# Altium project stm32f103.PrjPcb
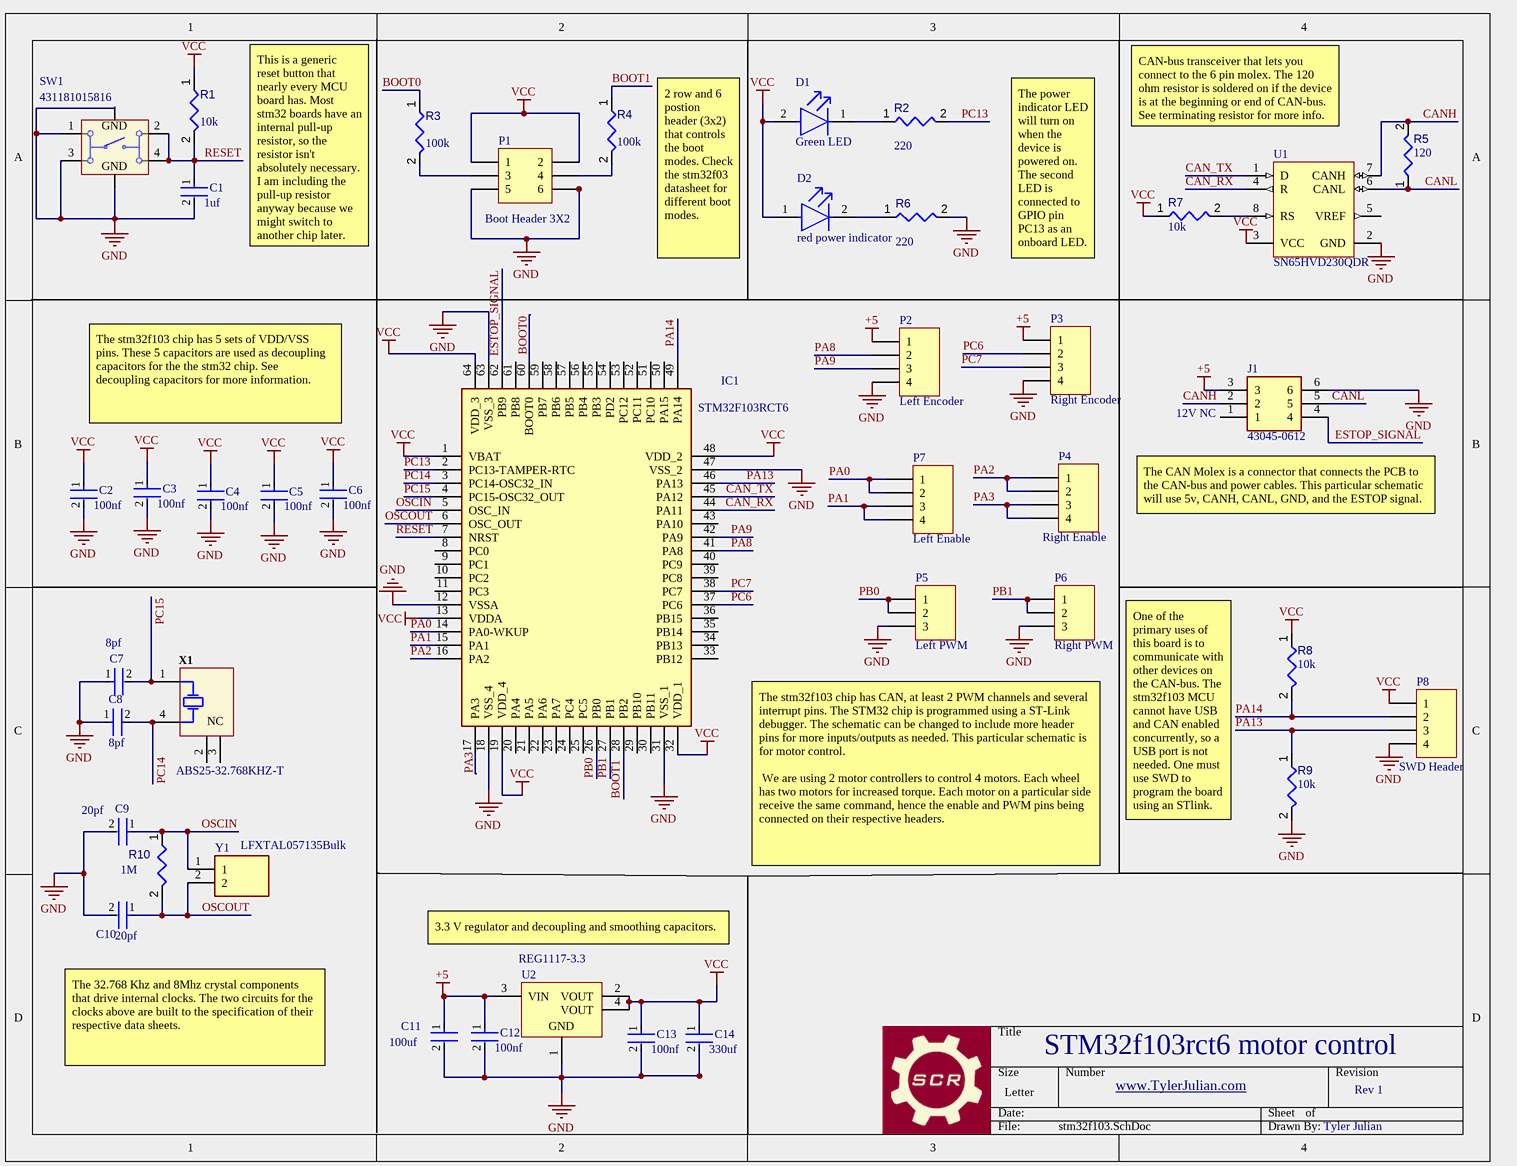
[diagram p0: stm32f103.SchDoc]
DrawnBy: Tyler Julian; Title: Stm32f103 Motor control board.
1 sheet, 41 parts. Net scope: global (net labels, ports and power ports of the same name join across sheets).
Board file: stm32f103.PcbDoc

## Sheet stm32f103.SchDoc: stm32f103 dev board
size Letter; Date: 0; ApprovedBy: 0*; CheckedBy: 0*; Author: 0*; CompanyName: 0; DrawnBy: 0; Engineer: 0*; Organization: 0; Address1: 0; Address2: 0*; Address3: 0*; Address4: 0; DocumentNumber: 0*; SheetNumber: 0; SheetTotal: 0; Parameter 1: 0; Time: 0*; ImagePath: 0*; Application_BuildNumber: 0*

### Parts
C1  1uf  [FP-GCJ21B-0_3-MFG]
C2  100nf  [FP-GCJ21B-0_3-MFG]
C3  100nf  [FP-GCJ21B-0_3-MFG]
C4  100nf  [FP-GCJ21B-0_3-MFG]
C5  100nf  [FP-GCJ21B-0_3-MFG]
C6  100nf  [FP-GCJ21B-0_3-MFG]
C7  8pf  [FP-GCJ21B-0_3-MFG]
C8  8pf  [FP-GCJ21B-0_3-MFG]
C9  20pf  [FP-GCJ21B-0_3-MFG]
C10  20pf  [FP-GCJ21B-0_3-MFG]
C11  100uf  [FP-GCJ21B-0_3-MFG]
C12  100nf  [FP-GCJ21B-0_3-MFG]
C13  100nf  [FP-GCJ21B-0_3-MFG]
C14  330uf  [FP-GCJ21B-0_3-MFG]
D1  Green LED  [FP-LG_R971-MFG]
D2  red power indicator  [FP-LH_R974-MFG]
IC1  STM32F103RCT6  [QFP50P1200X1200X160-64N]
J1  43045-0612  [430450612]
P1  Boot Header 3X2  [HDR2X3]
P2  Left Encoder  [HDR1X4]
P3  Right Encoder  [HDR1X4]
P4  Right Enable  [HDR1X4]
P5  Left PWM  [HDR1X3]
P6  Right PWM  [HDR1X3]
P7  Left Enable  [HDR1X4]
P8  SWD Header  [HDR1X4]
R1  value 10k  [RESC2013X50X35ML15T15]  (hidden comment: Resistor 10k +/-1% 0805 125 mW)
R2  value 220  [RESC2013X50X35ML15T15]  (hidden comment: Resistor 10k +/-1% 0805 125 mW)
R3  value 100k  [RESC2013X50X35ML15T15]  (hidden comment: Resistor 10k +/-1% 0805 125 mW)
R4  value 100k  [RESC2013X50X35ML15T15]  (hidden comment: Resistor 10k +/-1% 0805 125 mW)
R5  value 120  [RESC2013X50X35ML15T15]  (hidden comment: Resistor 10k +/-1% 0805 125 mW)
R6  value 220  [RESC2013X50X35ML15T15]  (hidden comment: Resistor 10k +/-1% 0805 125 mW)
R7  value 10k  [RESC2013X50X35ML15T15]  (hidden comment: Resistor 10k +/-1% 0805 125 mW)
R8  value 10k  [RESC2013X50X35ML15T15]  (hidden comment: Resistor 10k +/-1% 0805 125 mW)
R9  value 10k  [RESC2013X50X35ML15T15]  (hidden comment: Resistor 10k +/-1% 0805 125 mW)
R10  value 1M  [RESC2013X50X35ML15T15]  (hidden comment: Resistor 10k +/-1% 0805 125 mW)
SW1  431181015816  [431181015816]
U1  SN65HVD230QDR  [D0008A_L]
U2  REG1117-3.3  [DCY0004A_M]
X1  ABS25-32.768KHZ-T  [ABRA-ABS25-4_V]
Y1  LFXTAL057135Bulk  [LFXTAL057135Bulk]

### Nets
+5: C11.1 C12.1 J1.3 P2.1 P3.1 U2.3(VIN)
GND: C1.2 C2.2 C3.2 C4.2 C5.2 C6.2 C7.1 C8.1 C9.2 C10.2 C11.2 C12.2 C13.2 C14.2 IC1.12(VSSA) IC1.18(VSS_4) IC1.31(VSS_1) IC1.47(VSS_2) IC1.63(VSS_3) J1.6 P1.5 P1.6 P2.4 P3.4 P5.3 P6.3 P8.4 R6.2 R9.2 SW1.1 SW1.3 SW1.5 SW1.6 U1.2(GND) U2.1(GND)
VCC: C2.1 C3.1 C4.1 C5.1 C6.1 C13.1 C14.1 D1.2(A) D2.1(A) IC1.1(VBAT) IC1.13(VDDA) IC1.19(VDD_4) IC1.32(VDD_1) IC1.48(VDD_2) IC1.64(VDD_3) P1.1 P1.2 P8.1 R1.1 R7.1 R8.1 U1.3(VCC) U2.2(VOUT) U2.4(VOUT)
BOOT0: IC1.60(BOOT0) R3.1
BOOT1: IC1.28(PB2) R4.1
CAN_RX: IC1.44(PA11) U1.4(R)
CAN_TX: IC1.45(PA12) U1.1(D)
CANH: J1.2 R5.2 U1.7(CANH)
CANL: J1.5 R5.1 U1.6(CANL)
ESTOP_SIGNAL: IC1.62(PB9) J1.4
OSCIN: C9.1 IC1.5(OSC_IN) R10.1 Y1.1
OSCOUT: C10.1 IC1.6(OSC_OUT) R10.2 Y1.2
PA0: IC1.14(PA0-WKUP) P7.1 P7.2
PA1: IC1.15(PA1) P7.3 P7.4
PA2: IC1.16(PA2) P4.1 P4.2
PA3: IC1.17(PA3) P4.3 P4.4
PA8: IC1.41(PA8) P2.2
PA9: IC1.42(PA9) P2.3
PA13: IC1.46(PA13) P8.3 R9.1
PA14: IC1.49(PA14) P8.2 R8.2
PB0: IC1.26(PB0) P5.1 P5.2
PB1: IC1.27(PB1) P6.1 P6.2
PC6: IC1.37(PC6) P3.2
PC7: IC1.38(PC7) P3.3
PC13: IC1.2(PC13-TAMPER-RTC) R2.2
PC14: C8.2 IC1.3(PC14-OSC32_IN) X1.4(X2)
PC15: C7.2 IC1.4(PC15-OSC32_OUT) X1.1(X1)
RESET: C1.1 IC1.7(NRST) R1.2 SW1.2 SW1.4
NetD1_1: D1.1(C) R2.1
NetD2_2: D2.2(C) R6.1
NetP1_3: P1.3 R3.2
NetP1_4: P1.4 R4.2
NetR7_2: R7.2 U1.8(RS)

Not connected (* = marked no-connect by the designer): IC1 8(PC0) 9(PC1) 10(PC2) 11(PC3) 20(PA4) 21(PA5) 22(PA6) 23(PA7) 24(PC4) 25(PC5) 29(PB10) 30(PB11) 33(PB12) 34(PB13) 35(PB14) 36(PB15) 39(PC8) 40(PC9) 43(PA10) 50(PA15) 51(PC10) 52(PC11) 53(PC12) 54(PD2) 55(PB3) 56(PB4) 57(PB5) 58(PB6) 59(PB7) 61(PB8); J1 1; U1 5(VREF); X1 2(NC) 3(NC)

### Notes on the sheet
- CAN-bus transceiver that lets you connect to the 6 pin molex. The 120 ohm resistor is soldered on if the device is at the beginning or end of CAN-bus. See terminating resistor for more info.
- This is a generic reset button that nearly every MCU board has. Most stm32 boards have an internal pull-up resistor, so the resistor isn't absolutely necessary. I am including the pull-up resistor anyway because we might switch to another chip later.
- 2 row and 6 postion header (3x2) that controls the boot modes. Check the stm32f03 datasheet for different boot modes.
- The power indicator LED will turn on when the device is powered on. The second LED is connected to GPIO pin PC13 as an onboard LED.
- The stm32f103 chip has 5 sets of VDD/VSS pins. These 5 capacitors are used as decoupling capacitors for the the stm32 chip. See decoupling capacitors for more information.
- (near J1) 12V NC
- (near J1) The CAN Molex is a connector that connects the PCB to the CAN-bus and power cables. This particular schematic will use 5v, CANH, CANL, GND, and the ESTOP signal.
- One of the primary uses of this board is to communicate with other devices on the CAN-bus. The stm32f103 MCU cannot have USB and CAN enabled concurrently, so a USB port is not needed. One must use SWD to program the board using an STlink.
- The stm32f103 chip has CAN, at least 2 PWM channels and several interrupt pins. The STM32 chip is programmed using a ST-Link debugger. The schematic can be changed to include more header pins for more inputs/outputs as needed. This particular schematic is for motor control.
  We are using 2 motor controllers to control 4 motors. Each wheel has two motors for increased torque. Each motor on a particular side receive the same command, hence the enable and PWM pins being connected on their respective headers.
- (near U2) 3.3 V regulator and decoupling and smoothing capacitors.
- The 32.768 Khz and 8Mhz crystal components that drive internal clocks. The two circuits for the clocks above are built to the specification of their respective data sheets.
- STM32f103rct6 motor control
- www.TylerJulian.com <http://www.TylerJulian.com>
- Rev 1
- Tyler Julian
- 10
- 9
- 8
- 7
- 6
- 5
- 4
- 3
- DWG. NO.
- 2
- 1
- REV.
- SHT.
- REVISION
- DESCRIPTION
- DATE
- APPROVED
- H
- THIS DOCUMENT AND THE DATA DISCLOSED HEREIN OR HEREWITH IS THE PROPERTY OF ALTIUM LIMITED AND MAY BE FREELY DISTRIBUTED IN WHOLE. NO RIGHTS ARE RESERVED OR EXPRESS OR IMPLIED WARANTEE GIVEN.
- G
- F
- E
- D
- C
- B
- A
- TITLE
- SCALE:
- SIZE
- CAGE CODE
- FILE NAME
- DWG NO.
- SHEET
- OF
- REV
- (in symbol CMP-1457-00006-1) GND

### Library data of the parts
C1-C14 = CMP-2007-03211-2: Multilayer Ceramic Capacitors MLCC - SMD/SMT 0805 1uF 10%, 25VDC,  X7R 15%; Voltage Rating (DC): 25V; Package Quantity: 3000; Depth: 1.25mm; Packaging: Tape and Reel; Voltage Rating: 25V; Max Operating Temperature: 125°C; Ratings: AEC-Q200; Width: 1.25mm; Min Operating Temperature: -55°C; Termination: SMD/SMT; Lead Free: Lead Free; Dielectric: X7R; Length: 2mm; Thickness: 0.057inch; Capacitance: 1uF; Tolerance: 10%; Case Code (Metric): 2012; Case/Package: 0805; Mount: Surface Mount; Features: Soft Termination; Case Code (Imperial): 0805
D1 = CMP-62016-000039-1: LED GREEN DIFFUSED 0805 SMD / Q62702P5179; Test Current: 20mA; Power Dissipation: 65mW; Number of LEDs: 1; Viewing Angle: 160°; Lens Color: White; Lens Size: 1.25mm; Forward Voltage: 2.2V; Reverse Voltage: 12V; Forward Current: 25mA; Luminous Intensity: 45mcd; Luminous Flux: 0.1lm; Dominant Wavelength: 570nm; Min Operating Temperature: -30°C; Packaging: Tape and Reel; Radiation Hardening: No; Number of Pins: 2; Case Code (Imperial): 0805; Lens Style: Diffused; Mount: Surface Mount; Package Quantity: 1; Case Code (Metric): 2012; Color: Green; Case/Package: 0805; Width: 1.25mm; Illumination Color: Green; Lens Transparency: Diffused; Max Operating Temperature: 85°C; Number of Elements: 1; Depth: 1.35mm; Height: 0.9mm; Length: 2.1mm
D2 = CMP-2000-06540-2: LED RED DIFFUSED 0805 SMD / LH R974-LP-1; Number of Elements: 1; Forward Voltage: 2.6V; Viewing Angle: 160°; Reverse Voltage: 5V; Test Current: 20mA; Dominant Wavelength: 645nm; Forward Current: 30mA; Luminous Intensity: 15mcd; Depth: 1.35mm; Min Operating Temperature: -30°C; Length: 2.1mm; Max Operating Temperature: 85°C; Radiation Hardening: No; Packaging: Tape and Reel; Number of Pins: 2; Mount: Surface Mount; Lens Style: Diffused
IC1 = STM32F103RCT6: Integrated Circuit; Manufacturer_Name: STMicroelectronics; Datasheet Link: https://componentsearchengine.com//STM32F103RCT6.pdf; Height: 1.6mm; Mouser2 Part Number: 511-STM32F103RCT6; Mouser2 Price/Stock: https://www.mouser.com/Search/Refine.aspx?Keyword=511-STM32F103RCT6; Manufacturer_Part_Number: STM32F103RCT6
J1 = 43045-0612: Connector; Manufacturer_Name: Molex; Datasheet Link: https://www.molex.com/pdm_docs/sd/430452227_sd.pdf; Manufacturer_Part_Number: 43045-0612
P1 = Header 3X2: Header, 3-Pin, Dual row; LatestRevisionDate: 17-Jul-2002; LatestRevisionNote: Re-released for DXP Platform.; Publisher: Altium Limited
P2-P4 P7 P8 = Header 4: Header, 4-Pin; LatestRevisionDate: 17-Jul-2002; LatestRevisionNote: Re-released for DXP Platform.; Publisher: Altium Limited
P5 P6 = Header 3: Header, 3-Pin; LatestRevisionDate: 17-Jul-2002; LatestRevisionNote: Re-released for DXP Platform.; Publisher: Altium Limited
R1-R10 = CMP-009-00018-4: Chip Resistor, 10 KOhm, +/- 1%, 125 mW, -55 to 155 degC, 0805 (2012 Metric); Power: 125mW; Voltage Rating: 150V; RoHS Compliant: True; Mounting Technology: SM; Pins: 2; Case/Package: 0805; Min Operating Temperature: -55°C; Max Operating Temperature: 155°C; Tolerance: 1%
SW1 = CMP-1457-00006-1: WS-TASV SMD Tact Switch 5X5 mm with ground terminal; Manufacturer: Wuerth Elektronik; NoPins: 04; ComponentLink2URL: http://katalog.we-online.de/em/datasheet/431181015816.pdf; ComponentLink1URL: http://www.we-online.com; PackageReference: 431181015816; ComponentLink1Description: Manufacturer URL; ComponentLink2Description: Datasheet; PartNumber: 431181015816
U1 = CMP-0315-00033-2: Automotive Catalog 3.3 V CAN Transceiver, 17 mA, 3.3 V, -40 to 125 degC, 8-pin SOIC (D), Green (RoHS & no Sb/Br); Manufacturer: Texas Instruments; Transient Pulse Protection(V): -25 to 25; Receivers Per Package: 1; ICC(Max)(mA): 17; Supply Voltage(s)(V): 3.3; PackageDescription: 8-Pin Plastic Small Outline Integrated Circuit, 4.9 x 3.9 mm, Pitch 1.27 mm Pitch; Isolated: No; PackageReference: D0008A; SubFamily: CAN; PartNumber: SN65HVD230QDR; Footprint: PCA82C250; DatasheetVersion: SLOS346K; Drivers Per Package: 1; ComponentLink1URL: http://www.ti.com/lit/ds/symlink/sn65hvd230.pdf; PackageVersion: revM, Jun-2011; Code_JEDEC: MS-012AA; Rating: Catalog; Eco-Plan: Green (RoHS & no Sb/Br); ComponentLink1Description: Datasheet; Mounting Technology: Surface Mount
U2 = CMP-0395-00549-2: Single Output LDO, 800 mA, Fixed 3.3 V Output, 3.8 to 15 V Input, with Internal Current Limiting, 4-pin SOT-223 (DCY), -40 to 125 degC, Green (RoHS & no Sb/Br); Manufacturer: Texas Instruments; Vout Adj(Max)(V): 3.3; Vin(Max)(V): 15; Iq(Typ)(mA): 4; Iout(Max)(A): 0.8; Vdo(Typ)(mV): 1100; Vin(Min)(V): 3.8; SubFamily: Single Channel LDO; Rating: Catalog; Fixed Output Options(V): 5; ComponentLink1Description: Manufacturer URL; Eco-Plan: Green (RoHS & no Sb/Br); PackageReference: DCY0004A; Mounting Technology: Surface Mount; ComponentLink3Description: Package Specification; Vout Adj(Min)(V): 3.3; ComponentLink2URL: http://www.ti.com/general/docs/lit/getliterature.tsp?genericPartNumber=REG1117-33&fileType=pdf; PackageVersion: 4202506/B; ComponentLink3URL: http://www.ti.com/litv/pdf/mpds094a; Code_JEDEC: TO-261; ComponentLink1URL: http://www.ti.com/; ComponentLink2Description: Datasheet; PartNumber: REG1117-3.3; DatasheetVersion: SBVS001D; PackageDescription: 4-Pin Plastic Small Outline, Body 3.5 x 6.5 mm, Pitch 2.3 mm
X1 = CMP-2000-05037-1: Low Frequency Crystal, 32.768 KHz, -40 to 85 degC, 4-Pin SMD, RoHS, Tape and Reel; Load Capacitance: 12.5pF; Tolerance: 20PPM; Brand: ABRACON; ESR: 50kOhms; Case Length: 8mm; Case Width: 3.8mm; Case Height: 2.5mm; RoHS: Details; Product Category: Crystals; Frequency: 32.768kHz; Datasheet Version: May-11; Series: ABS25; Datasheet URL: https://datasheet.ciiva.com/7998/1700987-7998663.pdf; Termination Style: SMD/SMT; Package Reference: ABS25; Dimensions: 3.8mmWx8mmLx2.5mmH; Package / Case: 8mmx3.8mm; Manufacturer: Abracon; Manufacturer URL: http://www.abracon.com/; Mounting Style: SMD/SMT; Package Description: 4-Pin Surface Mount Device, Body 8 x 3.8 mm, Pitch 5.5 mm; Operating Temperature Range: -40Cto+85C; Factory Pack Quantity: 1000; Type: LowFrequencyCrystal; Packaging: Reel
Y1 = LFXTAL057135Bulk: Crystal or Oscillator; Manufacturer_Name: IQD; Datasheet Link: https://componentsearchengine.com/Datasheets/1/LFXTAL057135Bulk.pdf; Height: 4.1mm; Manufacturer_Part_Number: LFXTAL057135Bulk